# Altium schematic sheet GS_2CH_Motherboard.SchDoc
size A1; Dpartment: R&D; Date: 2024-10-27; DrawnBy: 杜龙彬; DocumentNumber: 2; Revision: V1.01; SheetNumber: 3; SheetTotal: 3; Model: 型号; Size: A1; Department: R&D; ProjectName: Vertex347-400V-1170W 2CH Digital
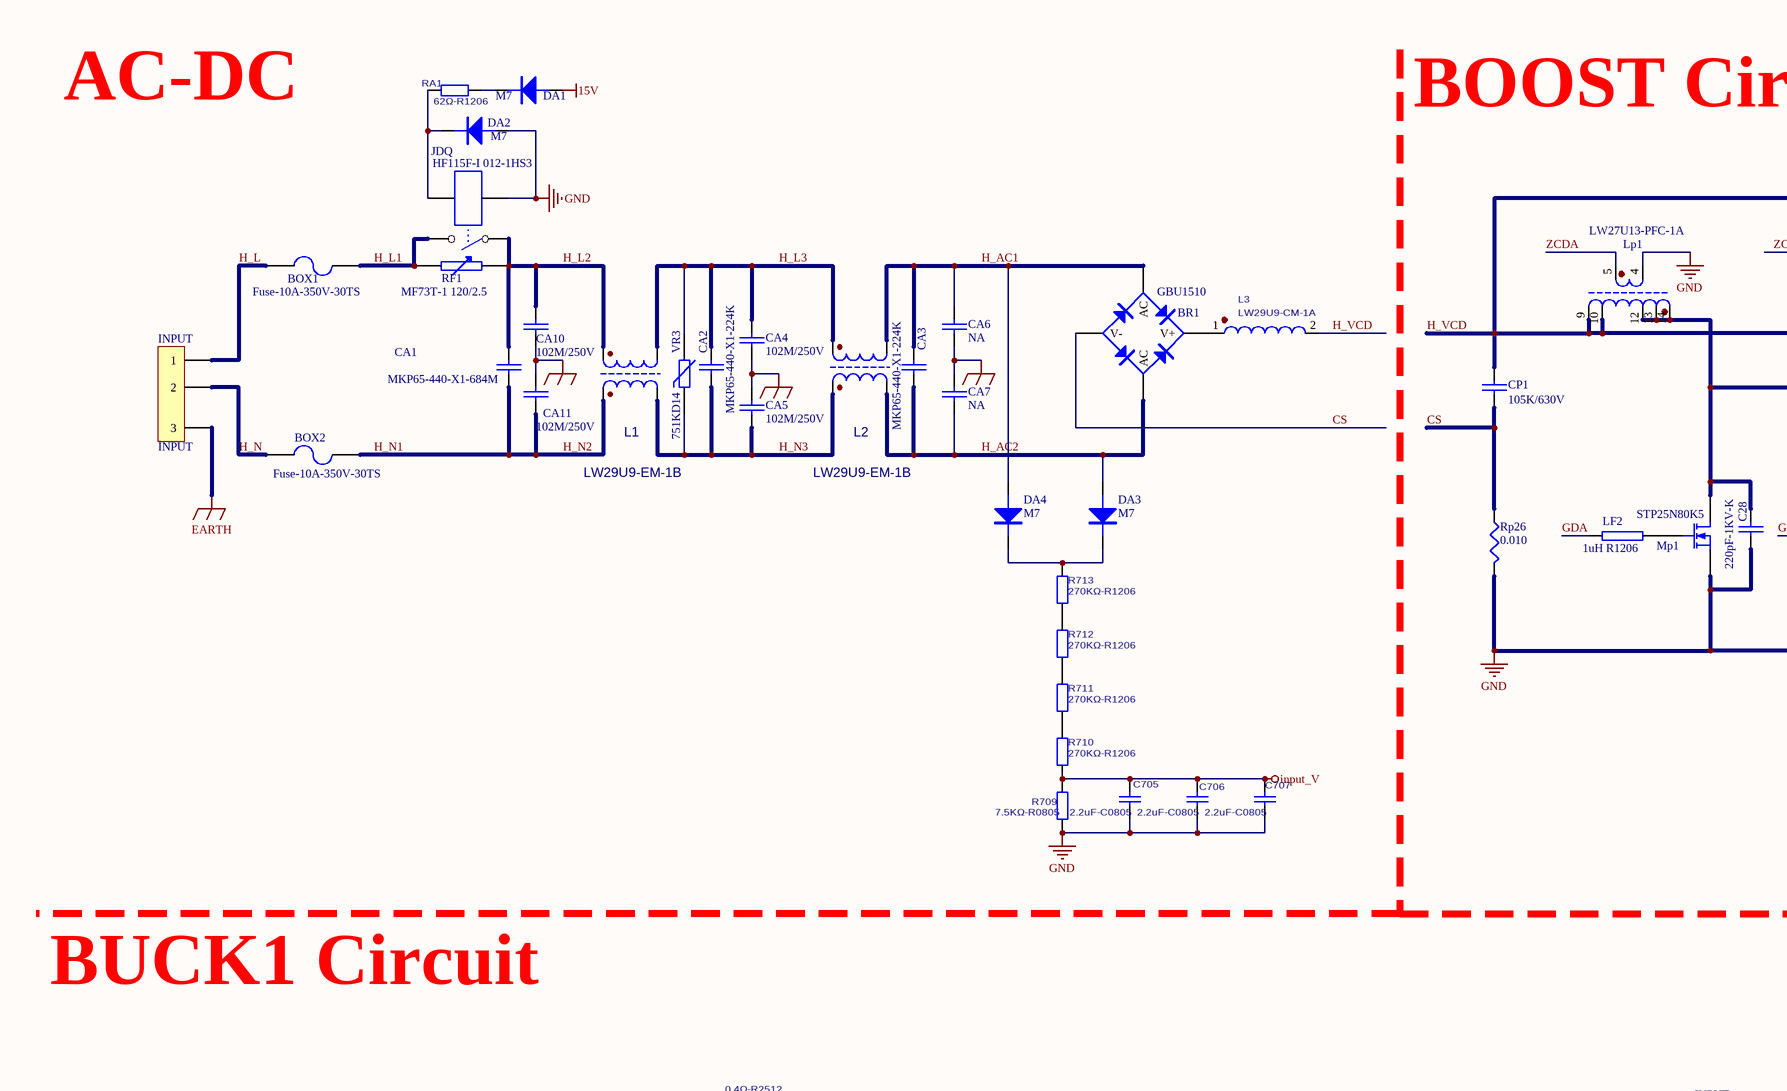
[diagram p0: GS_2CH_Motherboard.SchDoc, top left]
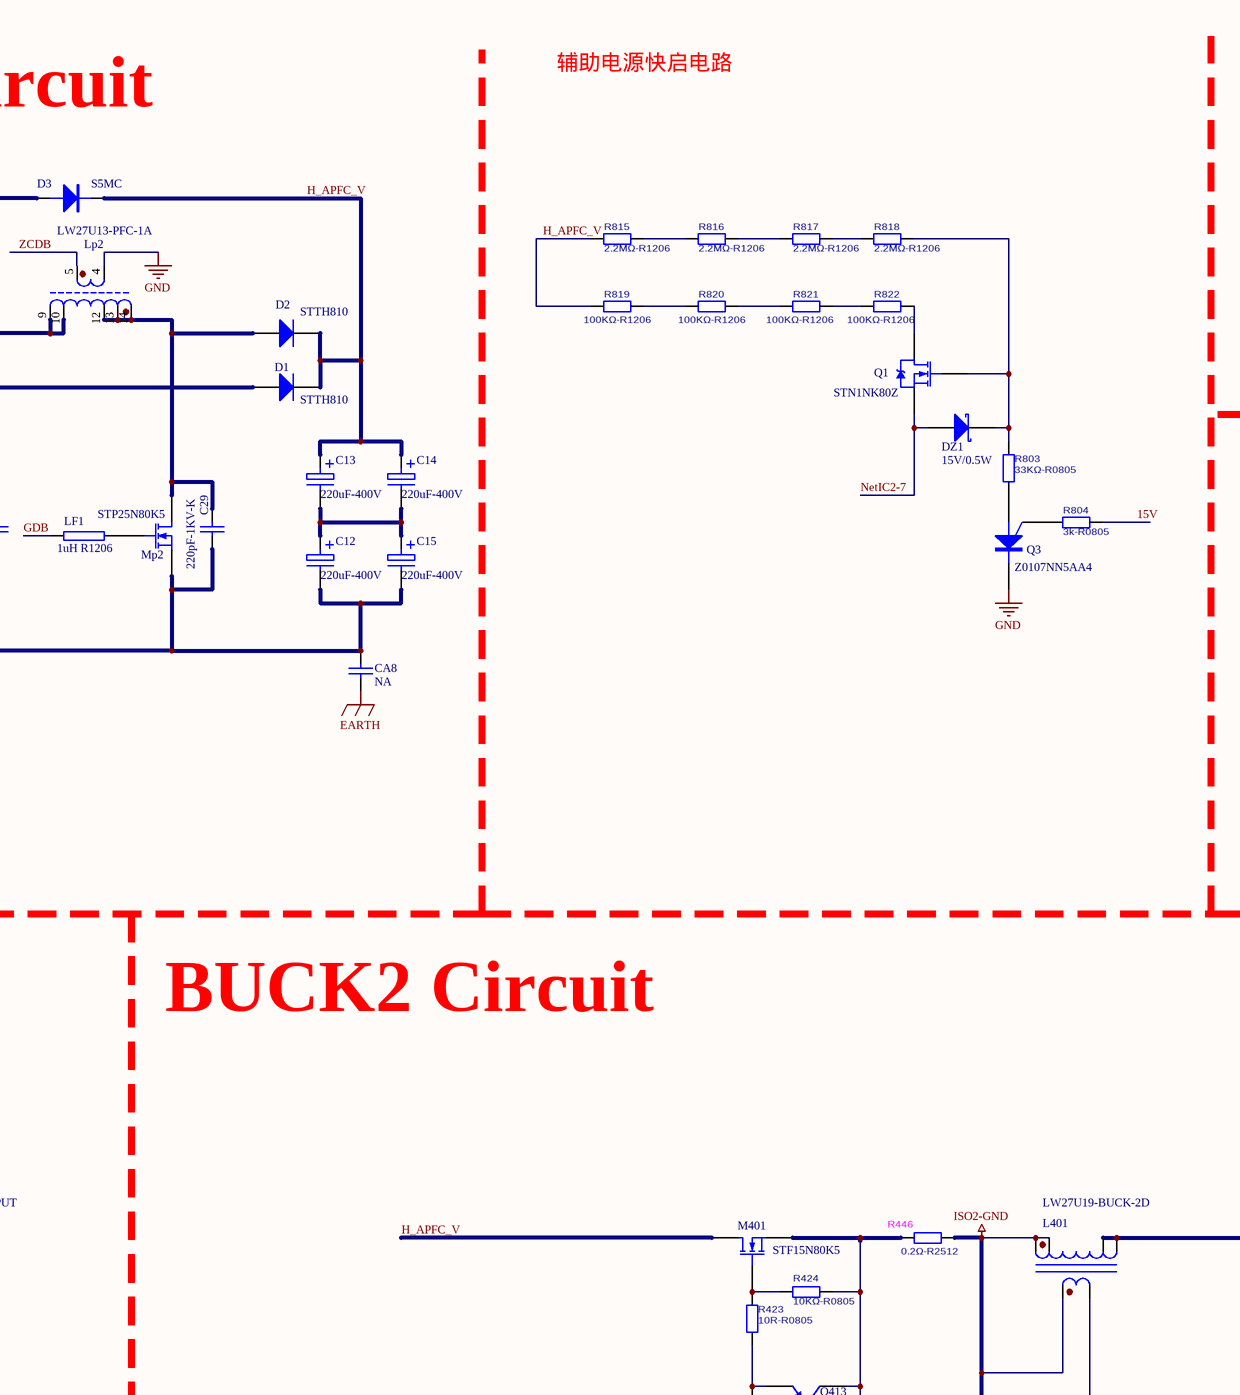
[diagram p1: GS_2CH_Motherboard.SchDoc, top middle]
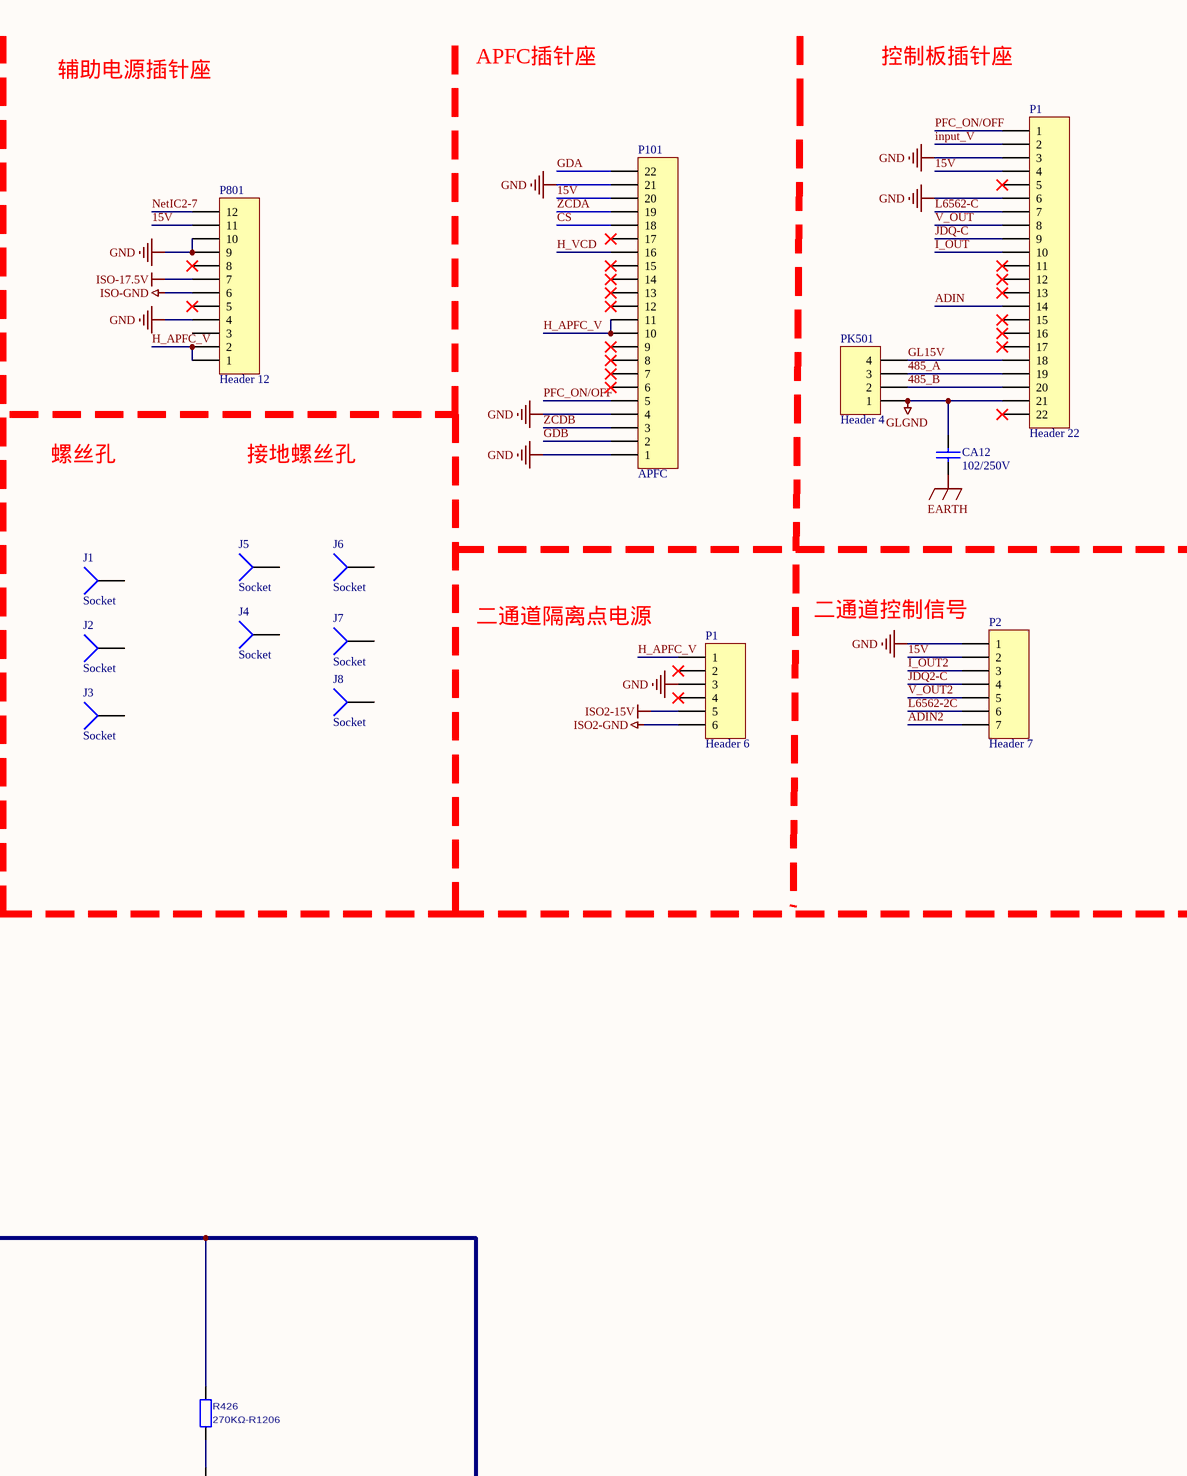
[diagram p2: GS_2CH_Motherboard.SchDoc, top right]
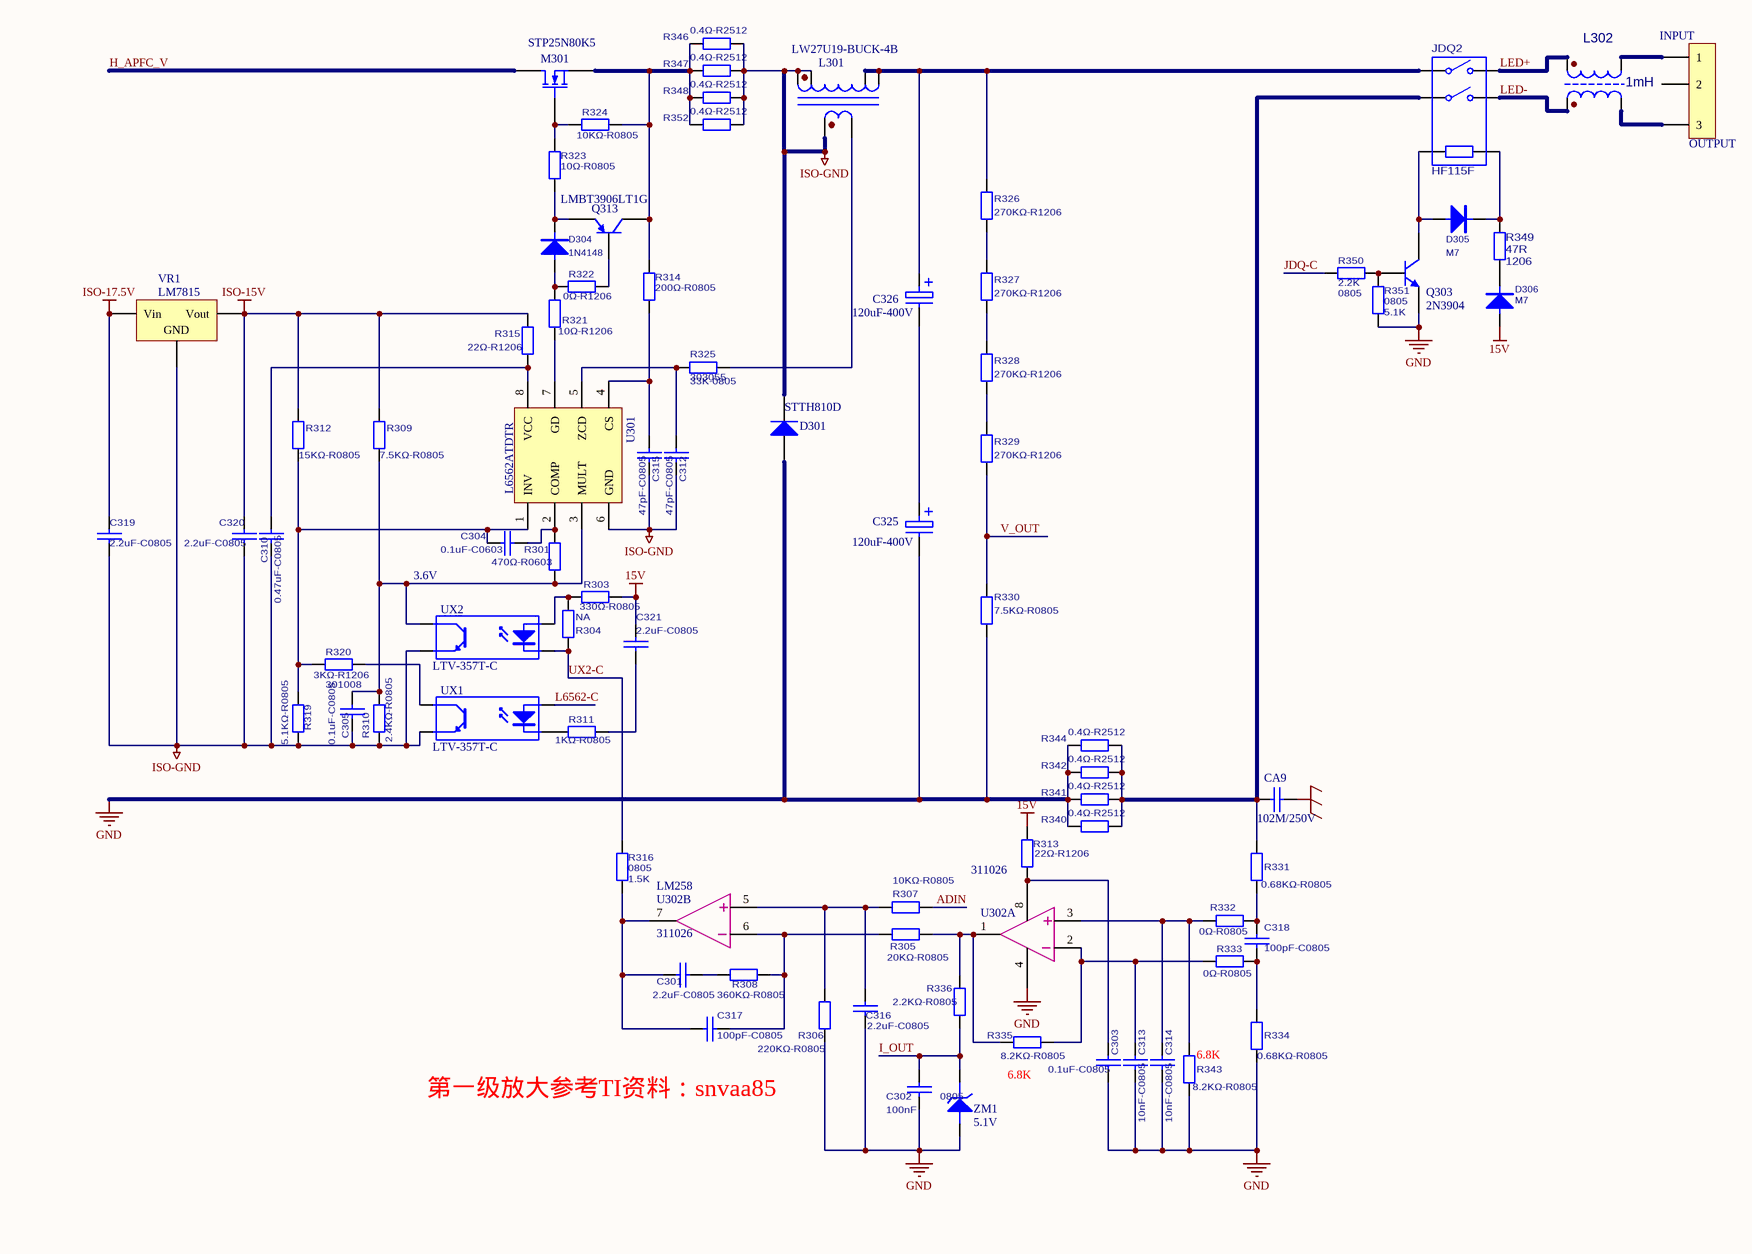
[diagram p3: GS_2CH_Motherboard.SchDoc, bottom left]
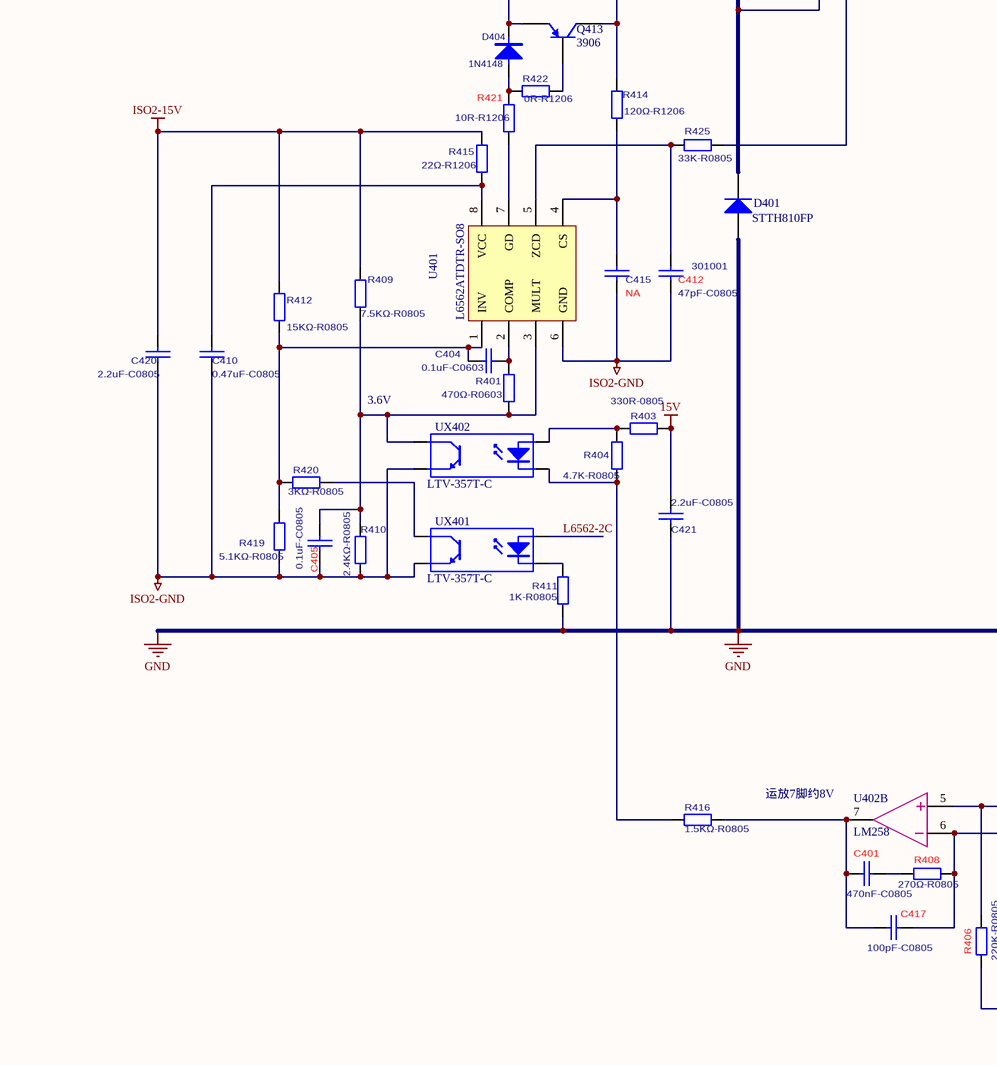
[diagram p4: GS_2CH_Motherboard.SchDoc, bottom middle]
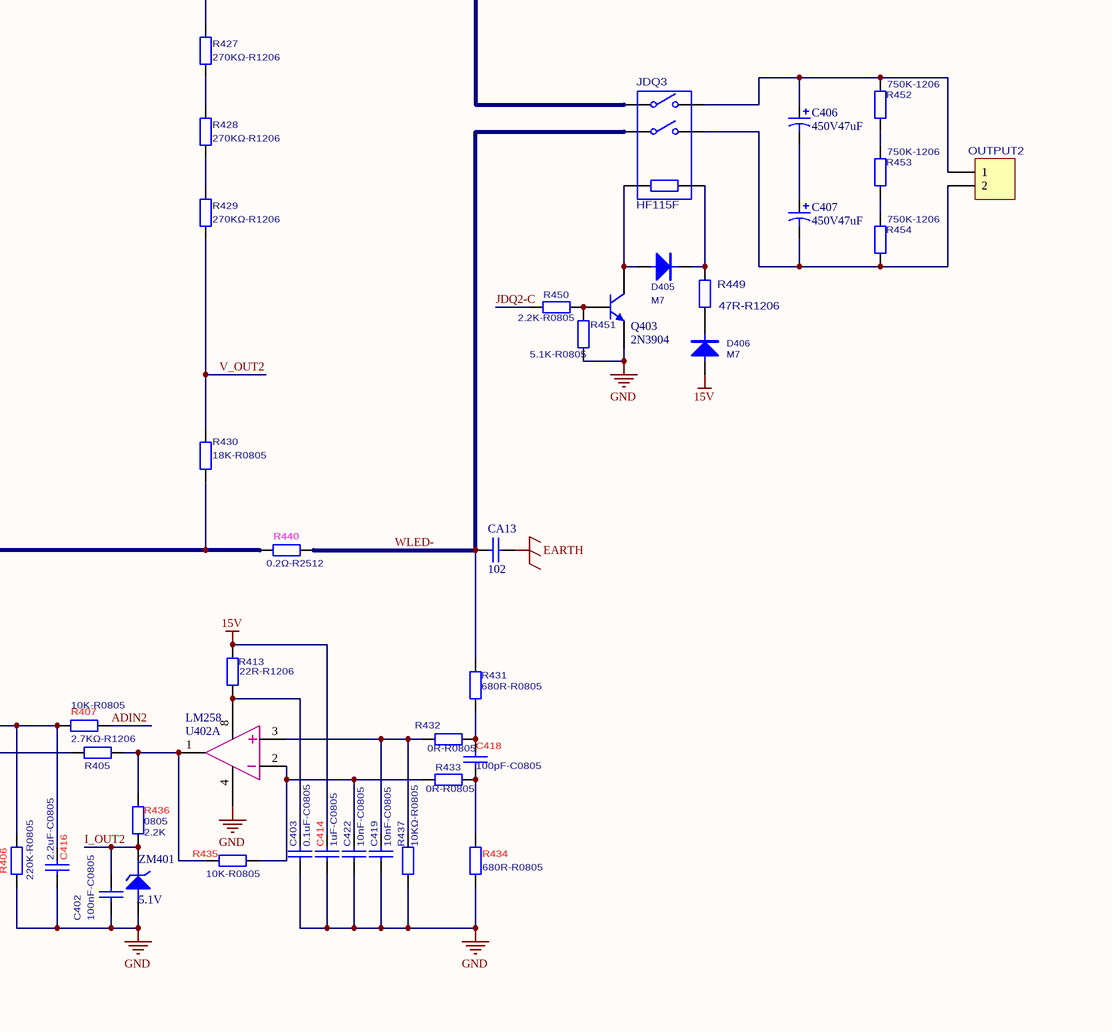
[diagram p5: GS_2CH_Motherboard.SchDoc, bottom right]

## Parts
(Parts that share a designator on the sheet are numbered #1, #2 ... from top to bottom, then left to right.)
?  OUTPUT2  [JST-3.96-2P]
BOX1  Fuse-10A-350V-30TS  [10A保险]
BOX2  Fuse-10A-350V-30TS  [10A保险]
BR1  GBU1510  [BRIDGE-TK]
C12  220uF-400V  [C250V/120uF]
C13  220uF-400V  [C250V/120uF]
C14  220uF-400V  [C250V/120uF]
C15  220uF-400V  [C250V/120uF]
C28  220pF-1KV-K  [Y2C]
C29  220pF-1KV-K  [Y2C]
C301  2.2uF-C0805  [RW0805]
C302  0805  value 100nF  [RW0805]
C303  0.1uF-C0805  [RW0805]
C304  value 0.1uF-C0603  [RW0603]
C305  301008  value 0.1uF-C0805  [RW0805]
C310  0.47uF-C0805  [RW0805]
C312  47pF-C0805  [RW0805]
C313  10nF-C0805  [RW0805]
C314  10nF-C0805  [RW0805]
C315  47pF-C0805  [RW0805]
C316  2.2uF-C0805  [RW0805]
C317  100pF-C0805  [RW0805]
C318  100pF-C0805  [RW0805]
C319  2.2uF-C0805  [RW0805]
C320  2.2uF-C0805  [RW0805]
C321  2.2uF-C0805  [RW0805]
C325  120uF-400V  [C250V/120uF]
C326  120uF-400V  [C250V/120uF]
C401  470nF-C0805  [RW0805]
C402  100nF-C0805  [RW0805]
C403  0.1uF-C0805  [RW0805]
C404  0.1uF-C0603  [RW0603]
C405  0.1uF-C0805  [RW0805]
C406  450V47uF  [CE12.5]
C407  450V47uF  [CE12.5]
C410  0.47uF-C0805  [RW0805]
C412  301001  [RW0805]
C414  1uF-C0805  [RW0805]
C415  (no value)  [RW0805]
C416  2.2uF-C0805  [RW0805]
C417  100pF-C0805  [RW0805]
C418  100pF-C0805  [RW0805]
C419  10nF-C0805  [RW0805]
C420  2.2uF-C0805  [RW0805]
C421  2.2uF-C0805  [RW0805]
C422  10nF-C0805  [RW0805]
C705  2.2uF-C0805  [RW0805]
C706  2.2uF-C0805  [RW0805]
C707  2.2uF-C0805  [RW0805]
CA1  MKP65-440-X1-684M  [2.2uF/400V]
CA2  MKP65-440-X1-224K  [X2C-B 22-27]
CA3  MKP65-440-X1-224K  [X2C-B 22-27]
CA4  102M/250V  [Y2C]
CA5  102M/250V  [Y2C]
CA6  NA  [Y2C]
CA7  NA  [Y2C]
CA8  NA  [Y2C]
CA9  102M/250V  [Y2C]
CA10  102M/250V  [Y2C]
CA11  102M/250V  [Y2C]
CA12  102/250V  [Y2C]
CA13  102  [Y2C]
CP1  105K/630V  [2.2UF/630VRCD]
D1  STTH810  [U880]
D2  STTH810  [U880]
D3  S5MC  [D-SMC]
D301  STTH810D  [U880]
D304  1N4148  [SOD-123]
D305  M7  [SMA]
D306  M7  [SMA]
D401  STTH810FP  [TO-220-KA]
D404  1N4148  [SOD-123]
D405  M7  [SMA]
D406  M7  [SMA]
DA1  M7  [M7]
DA2  M7  [M7]
DA3  M7  [M7]
DA4  M7  [M7]
DZ1  15V/0.5W  [SOD-123]
INPUT  INPUT  [INPUT-JST-6P]
J1  Socket  [螺丝孔]
J2  Socket  [螺丝孔]
J3  Socket  [螺丝孔]
J4  Socket  [接地标志]
J5  Socket  [接地标志]
J6  Socket  [接地标志]
J7  Socket  [接地标志]
J8  Socket  [接地标志]
JDQ  HF115F-I 012-1HS3  [RELAY-HF115F - 3]
JDQ2  HF115F  [RELAY-HF115F]
JDQ3  HF115F  [RELAY-HF115F]
L1  LW29U9-EM-1B  [L-EMC]
L2  LW29U9-EM-1B  [L-EMC]
L3  LW29U9-CM-1A  [差模电感27*27*15，P=12]
L301  LW27U19-BUCK-4B  [EE42/20]
L302  1mH  [B-CM22X12]
L401  LW27U19-BUCK-2D  [T-PQ2625]
LF1  1uH R1206  [RW1206]
LF2  1uH R1206  [RW1206]
Lp1  LW27U13-PFC-1A  [W1U15-PF-5A]
Lp2  LW27U13-PFC-1A  [W1U15-PF-5A]
M301  STP25N80K5  [TO220-3]
M401  STF15N80K5  [TO220VS]
Mp1  STP25N80K5  [TO220-3]
Mp2  STP25N80K5  [TO220-3]
OUTPUT  INPUT  [INPUT-JST-6P]
P1#1  Header 22  [HDR1X22]
P1#2  Header 6  [6P插座]
P2  Header 7  [2.0*7]
P101  APFC  [金手指-APFC]
P801  Header 12  [HDR1X12]
PK501  Header 4  [4针插座]
Q1  STN1NK80Z  [SOT-223-NPN]
Q3  Z0107NN5AA4  [SOT-223-NPN]
Q303  2N3904  [SOT-23-BEC]
Q313  LMBT3906LT1G  [SOT-23-BEC]
Q403  2N3904  [SOT-23-BEC]
Q413  3906  [SOT-23-BEC]
R301  470Ω-R0603  [RW0603]
R303  330Ω-R0805  [RW0805]
R304  NA  [RW0805]
R305  20KΩ-R0805  [RW0805]
R306  220KΩ-R0805  [RW0805]
R307  10KΩ-R0805  [RW0805]
R308  360KΩ-R0805  [RW0805]
R309  7.5KΩ-R0805  [RW0805]
R310  2.4KΩ-R0805  [RW0805]
R311  1KΩ-R0805  [RW0805]
R312  15KΩ-R0805  [RW0805]
R313  22Ω-R1206  [RW1206]
R314  200Ω-R0805  [RW0805]
R315  22Ω-R1206  [RW1206]
R316  0805  value 1.5K  [RW0805]
R319  5.1KΩ-R0805  [RW0805]
R320  3KΩ-R1206  [RW1206]
R321  10Ω-R1206  [RW1206]
R322  0Ω-R1206  [RW1206]
R323  10Ω-R0805  [RW0805]
R324  10KΩ-R0805  [RW0805]
R325  303055  value 33K-0805  [RW0805]
R326  270KΩ-R1206  [RW1206]
R327  270KΩ-R1206  [RW1206]
R328  270KΩ-R1206  [RW1206]
R329  270KΩ-R1206  [RW1206]
R330  7.5KΩ-R0805  [RW0805]
R331  0.68KΩ-R0805  [RW0805]
R332  0Ω-R0805  [RW0805]
R333  0Ω-R0805  [RW0805]
R334  0.68KΩ-R0805  [RW0805]
R335  8.2KΩ-R0805  [RW0805]
R336  2.2KΩ-R0805  [RW0805]
R340  0.4Ω-R2512  [RW2512]
R341  0.4Ω-R2512  [RW2512]
R342  0.4Ω-R2512  [RW2512]
R343  8.2KΩ-R0805  [RW0805]
R344  0.4Ω-R2512  [RW2512]
R346  0.4Ω-R2512  [RW2512]
R347  0.4Ω-R2512  [RW2512]
R348  0.4Ω-R2512  [RW2512]
R349  1206  value 47R  [RW1206]
R350  0805  value 2.2K  [RW0805]
R351  0805  value 5.1K  [RW0805]
R352  0.4Ω-R2512  [RW2512]
R401  470Ω-R0603  [RW0603]
R403  value 330R-0805  [RW0805]
R404  4.7K-R0805  [RW0805]
R405  2.7KΩ-R1206  [RW1206]
R406  220K-R0805  [RW0805]
R407  10K-R0805  [RW0805]
R408  270Ω-R0805  [RW0805]
R409  7.5KΩ-R0805  [RW0805]
R410  2.4KΩ-R0805  [RW0805]
R411  1K-R0805  [RW0805]
R412  15KΩ-R0805  [RW0805]
R413  22R-R1206  [RW1206]
R414  value 120Ω-R1206  [RW1206]
R415  22Ω-R1206  [RW1206]
R416  1.5KΩ-R0805  [RW0805]
R419  5.1KΩ-R0805  [RW0805]
R420  3KΩ-R0805  [RW0805]
R421  10R-R1206  [RW1206]
R422  0R-R1206  [RW1206]
R423  10R-R0805  [RW0805]
R424  10KΩ-R0805  [RW0805]
R425  33K-R0805  [RW0805]
R426  270KΩ-R1206  [RW1206]
R427  270KΩ-R1206  [RW1206]
R428  270KΩ-R1206  [RW1206]
R429  270KΩ-R1206  [RW1206]
R430  18K-R0805  [RW0805]
R431  680R-R0805  [RW0805]
R432  0R-R0805  [RW0805]
R433  0R-R0805  [RW0805]
R434  680R-R0805  [RW0805]
R435  10K-R0805  [RW0805]
R436  0805  value 2.2K  [RW0805]
R437  10KΩ-R0805  [RW0805]
R440  0.2Ω-R2512  [RW2512]
R446  0.2Ω-R2512  [RW2512]
R449  47R-R1206  [RW1206]
R450  2.2K-R0805  [RW0805]
R451  5.1K-R0805  [RW0805]
R452  750K-1206  [RW1206]
R453  750K-1206  [RW1206]
R454  750K-1206  [RW1206]
R709  7.5KΩ-R0805  [RW0805]
R710  270KΩ-R1206  [RW1206]
R711  270KΩ-R1206  [RW1206]
R712  270KΩ-R1206  [RW1206]
R713  270KΩ-R1206  [RW1206]
R803  33KΩ-R0805  [RW0805]
R804  3k-R0805  [RW0805]
R815  2.2MΩ-R1206  [RW1206]
R816  2.2MΩ-R1206  [RW1206]
R817  2.2MΩ-R1206  [RW1206]
R818  2.2MΩ-R1206  [RW1206]
R819  100KΩ-R1206  [RW1206]
R820  100KΩ-R1206  [RW1206]
R821  100KΩ-R1206  [RW1206]
R822  100KΩ-R1206  [RW1206]
RA1  62Ω-R1206  [RW1206]
RF1  MF73T-1 120/2.5  [热敏]
Rp26  0.010  [康铜丝]
U301  L6562ATDTR  [SO-8]
U302  311026  [SOP-8]  (parts A,B of 2)
U401  L6562ATDTR-SO8  [SO-8]
U402  LM258  [SOP-8]  (parts A,B of 2)
UX1  LTV-357T-C  [LTV]
UX2  LTV-357T-C  [LTV]
UX401  LTV-357T-C  [LTV]
UX402  LTV-357T-C  [LTV]
VR1  LM7815  [78M05]
VR3  751KD14  [YAMIN-7.62]
ZM1  5.1V  [二极管]
ZM401  5.1V  [二极管]

## Nets
15V: C321.1 C414.2 C421.1 D306.A D406.A DA1.1(A) P1#1.4 P2.2 P101.20 P801.11 R303.1 R313.2 R403.1 R413.2 R804.1
EARTH: CA4.2 CA5.1 CA6.2 CA7.1 CA8.2 CA9.2 CA10.2 CA11.1 CA12.2 CA13.2 INPUT.3
GLGND: CA12.1 P1#1.21 PK501.1
GND: C12.2 C15.2 C28.2 C29.2 C302.2 C303.2 C313.2 C314.2 C316.2 C325.2 C402.2 C403.2 C414.1 C416.2 C419.2 C421.2 C422.2 C705.1 C706.1 C707.1 CA8.1 D301.1 D401.1 DA2.1(A) JDQ.3 Lp1.4 Lp2.4 Mp1.3 Mp2.3 P1#1.3 P1#1.6 P1#2.3 P2.1 P101.1 P101.4 P101.21 P801.4 P801.9 P801.10 Q3.B(K) Q303.E Q403.E R306.1 R330.1 R334.2 R340.1 R341.1 R342.1 R343.2 R344.1 R351.1 R406.1 R411.1 R430.1 R434.2 R437.2 R440.1 R451.1 R709.1 Rp26.2 U302.4(U-) U402.4(U-) ZM1.1(A) ZM401.1(A)
input_V: C705.2 C706.2 C707.2 P1#1.2 R709.2 R710.2
ISO2-15V: C420.1 P1#2.5 R409.2 R412.1 R415.2
ISO2-GND: C405.1 C410.2 C412.2 C415.2 C420.2 D401.3 L401.5 L401.8 L401.9 P1#2.6 R410.1 R419.1 R446.2 U401.6(GND) UX401.3(E) UX402.3(E)
ISO-15V: C320.1 R309.2 R312.1 R315.2 VR1.3(Vout)
ISO-17.5V: C319.1 P801.7 VR1.1(Vin)
ISO-GND: C305.1 C310.2 C312.2 C315.2 C319.2 C320.2 D301.2 L301.6 L301.7 L301.8 P801.6 R310.1 R319.1 R346.2 R347.2 R348.2 R352.2 U301.6(GND) UX1.3(E) UX2.3(E) VR1.2(GND)
485_A: P1#1.19 PK501.3
485_B: P1#1.20 PK501.2
ADIN: P1#1.14 R307.2
ADIN2: P2.7 R407.2
CS: BR1.1(V-) CP1.2 P101.18 Rp26.1
GDA: LF2.1 P101.22
GDB: LF1.1 P101.2
GL15V: P1#1.18 PK501.4
H_AC1: BR1.3(AC) CA3.1 CA6.1 DA4.1(A) L2.4
H_AC2: BR1.2(AC) CA3.2 CA7.2 DA3.1(A) L2.2
H_APFC_V: C13.1 C14.1 D1.2(K) D2.2 D3.2(K) M301.2 M401.2 P1#2.1 P101.10 P101.11 P801.1 P801.2 R815.1 R819.1
H_L: BOX1.1 INPUT.1
H_L1: BOX1.2 JDQ.1 RF1.1
H_L2: CA1.1 CA10.1 JDQ.2 L1.3 RF1.2
H_L3: CA2.1 CA4.1 L1.4 L2.3 VR3.1
H_N: BOX2.2 INPUT.2
H_N1: BOX2.1 CA1.2 CA11.2 L1.1  [also labelled H_N2]
H_N3: CA2.2 CA5.2 L1.2 L2.1 VR3.2
H_VCD: CP1.1 D3.1(A) L3.2 Lp1.9 Lp1.10 Lp2.9 Lp2.10 P101.16
I_OUT: C302.1 P1#1.10 R336.2 ZM1.2(K)
I_OUT2: C402.1 P2.3 R436.2 ZM401.2(K)
JDQ2-C: P2.4 R450.1
JDQ-C: P1#1.9 R350.1
L6562-2C: P2.6 UX401.1(A)
L6562-C: P1#1.7 UX1.1(A)
LED+: JDQ2.3 L302.3
LED-: JDQ2.4 L302.1
NetIC2-7: DZ1.1(A) P801.12 Q1.E
PFC_ON/OFF: P1#1.1 P101.5
UX2-C: R304.2 R316.1 UX2.2(K)
V_OUT: P1#1.8 R329.2 R330.2
V_OUT2: P2.5 R429.2 R430.2
WLED-: CA13.1 JDQ3.5 R431.1 R440.2
ZCDA: Lp1.5 P101.19
ZCDB: Lp2.5 P101.3
Net?_1: ?.1 C406.+ JDQ3.4 R452.2
Net?_2: ?.2 C407.- JDQ3.3 R454.1
NetBR1_4: BR1.4(V+) L3.1
NetC12_1: C12.1 C13.2 C14.2 C15.1
NetC28_1: C28.1 D1.1(A) Lp1.12 Lp1.13 Lp1.14 Mp1.2
NetC29_1: C29.1 D2.1 Lp2.12 Lp2.13 Lp2.14 Mp2.2
NetC301_1: C301.1 R308.1
NetC301_2: C301.2 C317.2 R316.2 U302.7
NetC303_1: C303.1 R313.1 U302.8(U+)
NetC304_1: C304.1 R301.1 U301.2(COMP)
NetC304_2: C304.2 R312.2 R319.2 R320.2 U301.1(INV)
NetC305_2: C305.2 R301.2 R309.1 R310.2 U301.3(MULT) UX2.4(C)
NetC310_1: C310.1 R315.1 U301.8(VCC)
NetC312_1: C312.1 R325.1 U301.5(ZCD)
NetC313_1: C313.1 R333.1 R335.1 U302.2
NetC314_1: C314.1 R332.2 R343.1 U302.3
NetC315_1: C315.1 R314.1 U301.4(CS)
NetC316_1: C316.1 R306.2 R307.1 U302.5
NetC317_1: C317.1 R305.1 R308.2 U302.6
NetC318_1: C318.1 R331.2 R332.1
NetC318_2: C318.2 R333.2 R334.1
NetC321_2: C321.2 R311.1
NetC325_1: C325.1 C326.2
NetC326_1: C326.1 JDQ2.5 L301.10 L301.11 R326.1
NetC401_1: C401.1 R408.1
NetC401_2: C401.2 C417.2 R416.2 U402.7
NetC403_1: C403.1 R413.1 U402.8(U+)
NetC404_1: C404.1 R401.1 U401.2(COMP)
NetC404_2: C404.2 R412.2 R419.2 R420.2 U401.1(INV)
NetC405_2: C405.2 R401.2 R409.1 R410.2 U401.3(MULT) UX402.4(C)
NetC406_-: C406.- C407.+
NetC410_1: C410.1 R415.1 U401.8(VCC)
NetC412_1: C412.1 R425.1 U401.5(ZCD)
NetC415_1: C415.1 R414.1 U401.4(CS)
NetC416_1: C416.1 R406.2 R407.1 U402.5
NetC417_1: C417.1 R405.1 R408.2 U402.6
NetC418_1: C418.1 R431.2 R432.1
NetC418_2: C418.2 R433.2 R434.1
NetC419_1: C419.1 R432.2 R437.1 U402.3
NetC422_1: C422.1 R433.1 R435.1 U402.2
NetCA9_1: CA9.1 JDQ2.6 R331.1 R340.2 R341.2 R342.2 R344.2
NetD304_A: D304.A R321.1 R322.1
NetD304_K: D304.K Q313.E R323.1
NetD305_A: D305.A JDQ2.1 Q303.C
NetD305_K: D305.K JDQ2.2 R349.2
NetD306_K: D306.K R349.1
NetD404_A: D404.A R421.1 R422.1
NetD404_K: D404.K Q413.E R423.1
NetD405_A: D405.A JDQ3.1 Q403.C
NetD405_K: D405.K JDQ3.2 R449.2
NetD406_K: D406.K R449.1
NetDA1_2: DA1.2(K) RA1.2
NetDA2_2: DA2.2(K) JDQ.4 RA1.1
NetDA3_2: DA3.2(K) DA4.2(K) R713.1
NetDZ1_2: DZ1.2(K) Q1.B R803.1 R818.2
NetJDQ3_6: JDQ3.6 L401.10 L401.11 R426.1
NetL301_4: L301.4 R325.2
NetL302_2: L302.2 OUTPUT.3
NetL302_4: L302.4 OUTPUT.1
NetL401_2: L401.2 R425.2
NetLF1_2: LF1.2 Mp2.1
NetLF2_2: LF2.2 Mp1.1
NetM301_1: M301.1 R323.2 R324.2
NetM301_3: M301.3 Q313.C R314.2 R324.1 R346.1 R347.1 R348.1 R352.1
NetM401_1: M401.1 R423.2 R424.2
NetM401_3: M401.3 Q413.C R414.2 R424.1 R446.1
NetQ1_C: Q1.C R822.2
NetQ3_C: Q3.C(A) R803.2
NetQ3_E: Q3.E(G) R804.2
NetQ303_B: Q303.B R350.2 R351.2
NetQ313_B: Q313.B R322.2
NetQ403_B: Q403.B R450.2 R451.2
NetQ413_B: Q413.B R422.2
NetR303_2: R303.2 R304.1 UX2.1(A)
NetR305_2: R305.2 R335.2 R336.1 U302.1
NetR311_2: R311.2 UX1.2(K)
NetR320_1: R320.1 UX1.4(C)
NetR321_2: R321.2 U301.7(GD)
NetR326_2: R326.2 R327.1
NetR327_2: R327.2 R328.1
NetR328_2: R328.2 R329.1
NetR403_2: R403.2 R404.1 UX402.1(A)
NetR404_2: R404.2 R416.1 UX402.2(K)
NetR405_2: R405.2 R435.2 R436.1 U402.1
NetR411_2: R411.2 UX401.2(K)
NetR420_1: R420.1 UX401.4(C)
NetR421_2: R421.2 U401.7(GD)
NetR426_2: R426.2 R427.1
NetR427_2: R427.2 R428.1
NetR428_2: R428.2 R429.1
NetR452_1: R452.1 R453.2
NetR453_1: R453.1 R454.2
NetR710_1: R710.1 R711.2
NetR711_1: R711.1 R712.2
NetR712_1: R712.1 R713.2
NetR815_2: R815.2 R816.1
NetR816_2: R816.2 R817.1
NetR817_2: R817.2 R818.1
NetR819_2: R819.2 R820.1
NetR820_2: R820.2 R821.1
NetR821_2: R821.2 R822.1

Not connected (* = marked no-connect by the designer): J1 1; J2 1; J3 1; J4 1; J5 1; J6 1; J7 1; J8 1; OUTPUT 2; P1#1 5* 11* 12* 13* 15* 16* 17* 22*; P1#2 2* 4*; P101 6* 7* 8* 9* 12* 13* 14* 15* 17*; P801 3 5* 8*

## Notes on the sheet
- APFC插针座
- 控制板插针座
- AC-DC
- BOOST Circuit
- 辅助电源快启电路
- 辅助电源插针座
- 螺丝孔
- 接地螺丝孔
- 二通道隔离点电源
- 二通道控制信号
- BUCK1 Circuit
- BUCK2 Circuit
- (near UX2) 3.6V
- (near UX402) 3.6V
- (near R335) 6.8K
- (near R343) 6.8K
- 第一级放大参考TI资料：snvaa85
- 运放7脚约8V
- ProjectName：
- Model：
- Department:
- Size:
- Revision:
- Drawn By:
- SheetTotal:
- Date:
- SheetNumber:
- (in symbol C) 47pF-C0805; NA
- (in symbol LM393, part B) LM258
- (in symbol 直插电解电容) +

## Library data of the parts
? = Header 2: 接线端子; LatestRevisionDate: 17-Jul-2002; LatestRevisionNote: Re-released for DXP Platform.; Publisher: Altium Limited
BOX1 BOX2 = FUSE2: Fuse
BR1 = BRIEGR
C12-C15 C325 C326 = 直插电解电容: 直插电容
C28 C29 C302 C318 C402 C418 = C
C301 C303-C305 C313 C314 C316 C317 C401 C403-C405 C414 C416 C417 C419 C422 = CAP: 贴片电容
C310 C312 C315 C319-C321 C410 C412 C415 C420 C421 = C: 贴片电容
C406 C407 = Cap Pol2: Polarized Capacitor (Axial); Value: 2.2uF 275VAC; Published: 8-Jun-2000; LatestRevisionDate: 17-Jul-2002; LatestRevisionNote: Re-released for DXP Platform.; PackageReference: POLAR0.8; Publisher: Altium Limited
C705-C707 = Cap: 贴片电容; Published: 8-Jun-2000; LatestRevisionDate: 17-Jul-2002; LatestRevisionNote: Re-released for DXP Platform.; PackageReference: RAD-0.3; Publisher: Altium Limited; PackageDescription: Radial Cap, Thru-Hole; 2 Leads; 0.3 in Pin Spacing
CA1-CA13 CP1 = CAP: Capacitor
D1 D2 = Diode 1N914: High Conductance Fast Diode; pin to pad: 1>3 2>1; Published: 8-Jun-2000; LatestRevisionDate: 17-Jul-2002; LatestRevisionNote: Re-released for DXP Platform.; DatasheetDocument: 1997; PackageReference: DO-35; Publisher: Altium Limited; Code_JEDEC: DO-204-AH; ComponentLink1Description: Manufacturer Link; ComponentLink1URL: http://www.fairchildsemi.com/; ComponentLink2Description: Datasheet; ComponentLink2URL: http://www.fairchildsemi.com/ds/1N%2F1N4448.pdf
D3 DA1-DA4 = DIO: pin to pad: 1>A 2>K
D301 = Diode 1N914: 直插二极管; pin to pad: 1>3 2>1; Published: 8-Jun-2000; LatestRevisionDate: 17-Jul-2002; LatestRevisionNote: Re-released for DXP Platform.; DatasheetDocument: 1997; PackageReference: DO-35; Publisher: Altium Limited; Code_JEDEC: DO-204-AH; ComponentLink1Description: Manufacturer Link; ComponentLink1URL: http://www.fairchildsemi.com/; ComponentLink2Description: Datasheet; ComponentLink2URL: http://www.fairchildsemi.com/ds/1N%2F1N4448.pdf
D304 D404 = DIO: 贴片二极管
D305 D306 D405 D406 = DIO
D401 = Diode 1N914: 直插二极管; pin to pad: 1>A 3>K; Published: 8-Jun-2000; LatestRevisionDate: 17-Jul-2002; LatestRevisionNote: Re-released for DXP Platform.; DatasheetDocument: 1997; PackageReference: DO-35; Publisher: Altium Limited; Code_JEDEC: DO-204-AH; ComponentLink1Description: Manufacturer Link; ComponentLink1URL: http://www.fairchildsemi.com/; ComponentLink2Description: Datasheet; ComponentLink2URL: http://www.fairchildsemi.com/ds/1N%2F1N4448.pdf
DZ1 = D Schottky: Schottky Diode; pin to pad: 1>A 2>K; Published: 8-Jun-2000; LatestRevisionDate: 17-Jul-2002; LatestRevisionNote: Re-released for DXP Platform.; Publisher: Altium Limited; Code_JEDEC: DO-214-AA
INPUT OUTPUT = CON6: Connector
JDQ = RELAY-SPST
JDQ2 JDQ3 = Relay - 两组常开: Dual-Pole Single-Throw Relay; Published: 24-Mar-1999; LatestRevisionDate: 17-Jul-2002; LatestRevisionNote: Re-released for DXP Platform.; PackageReference: MODULE6; Publisher: Altium Limited
L1 L2 L302 = L1
L3 = 差模电感
L301 L401 = inductance2
LF1 LF2 = RES
Lp1 Lp2 = L-PFC-33262
M301 = MOSFET-N: TO220mos管; pin to pad: 1>G 2>D 3>S; PackageDocument: 1995/1996; Published: 8-Jun-2000; LatestRevisionDate: 17-Jul-2002; LatestRevisionNote: Re-released for DXP Platform.; PackageReference: E3; Publisher: Altium Limited
M401 = MOSFET-N: TO220mos管; PackageDocument: 1995/1996; Published: 8-Jun-2000; LatestRevisionDate: 17-Jul-2002; LatestRevisionNote: Re-released for DXP Platform.; PackageReference: E3; Publisher: Altium Limited
Mp1 Mp2 = MOSFET-N: N-Channel MOSFET; pin to pad: 1>G 2>D 3>S; PackageDocument: 1995/1996; Published: 8-Jun-2000; LatestRevisionDate: 17-Jul-2002; LatestRevisionNote: Re-released for DXP Platform.; PackageReference: E3; Publisher: Altium Limited
P1#1 P101 = Header 22: Header, 22-Pin; LatestRevisionDate: 17-Jul-2002; LatestRevisionNote: Re-released for DXP Platform.; Publisher: Altium Limited
P1#2 = Header 6: Header, 6-Pin; LatestRevisionDate: 17-Jul-2002; LatestRevisionNote: Re-released for DXP Platform.; Publisher: Altium Limited
P2 = Header 7: Header, 7-Pin; LatestRevisionDate: 17-Jul-2002; LatestRevisionNote: Re-released for DXP Platform.; Publisher: Altium Limited
P801 = Header 12: Header, 12-Pin; LatestRevisionDate: 17-Jul-2002; LatestRevisionNote: Re-released for DXP Platform.; Publisher: Altium Limited
PK501 = Header 4: Header, 4-Pin; LatestRevisionDate: 17-Jul-2002; LatestRevisionNote: Re-released for DXP Platform.; Publisher: Altium Limited
Q1 = NMOS-2: N-Channel Power MOSFET; Note: Pin 2 is electrically connected to pin 4.; Published: 8-Jun-2000; LatestRevisionDate: 17-Jul-2002; LatestRevisionNote: Re-released for DXP Platform.; DatasheetDocument: PD-9.814; PackageReference: TO-220AB; Code_JEDEC: TO-220-AB; ComponentLink1Description: Manufacturer Link; ComponentLink1URL: http://www.irf.com/
Q3 = PUT: Programmable Unijunction Transistor; Published: 8-Jun-2000; LatestRevisionDate: 17-Jul-2002; LatestRevisionNote: Re-released for DXP Platform.
Q303 Q403 = NPN: NPN Bipolar Transistor; Published: 8-Jun-2000; LatestRevisionDate: 17-Jul-2002; LatestRevisionNote: Re-released for DXP Platform.; PackageReference: TO-226; Publisher: Altium Limited; Code_JEDEC: TO-226-AA
Q313 Q413 = PNP: 贴片三极管; Published: 8-Jun-2000; LatestRevisionDate: 17-Jul-2002; LatestRevisionNote: Re-released for DXP Platform.; PackageReference: SOT-23B; Publisher: Altium Limited; Code_JEDEC: SOT-23
R301 R303-R315 R319-R330 R340-R342 R344 R346-R348 R352 R401 R403-R415 R419-R430 R440 R446 R452-R454 R709-R713 RA1 = Res2: 贴片电阻; Published: 8-Jun-2000; LatestRevisionDate: 17-Jul-2002; LatestRevisionNote: Re-released for DXP Platform.; PackageReference: AXIAL-0.4; Publisher: Altium Limited
  R305 R405 R709: PackageDescription: Axial Device, Thru-Hole; 2 Leads; 0.4 in Pin Spacing
R316 R331-R336 R343 R349-R351 R416 R431-R437 R449-R451 R803 R804 R815-R822 = Res2: Resistor; Published: 8-Jun-2000; LatestRevisionDate: 17-Jul-2002; LatestRevisionNote: Re-released for DXP Platform.; PackageReference: AXIAL-0.4; Publisher: Altium Limited
  R803 R804 R815-R822: PackageDescription: Axial Device, Thru-Hole; 2 Leads; 0.4 in Pin Spacing
RF1 = RES4
Rp26 = RES1
U301 U401 = L6562: 贴片集成电路
U302 U402 = LM393: 贴片集成电路
UX1 UX2 UX401 UX402 = Optoisolator1: 贴片光耦; Published: 24-Mar-1999; LatestRevisionDate: 04-Mar-2005; LatestRevisionNote: Sch pins 3 & 4 Swapped.; DatasheetDocument: Nov-2003; PackageReference: DIP-4; Publisher: Altium Limited
VR1 = Volt Reg: Voltage Regulator; Published: 24-Mar-1999; LatestRevisionDate: 17-Jul-2002; LatestRevisionNote: Re-released for DXP Platform.; PackageReference: D2PAK; Publisher: Altium Limited; Code_JEDEC: SMD-220
VR3 = VARISTOR
ZM1 ZM401 = 稳压管
J1-J8 = Socket: LatestRevisionDate: 17-Jul-2002; LatestRevisionNote: Re-released for DXP Platform.; Publisher: Altium Limited